# Altium schematic sheet SHDN-CURRENT-S06-V00-5kWSimulation.SchDoc: 5kW Simulation
size A3; DrawnBy: Jonn Dillon; DocumentNumber: 5; SheetNumber: 5; SheetTotal: 14; Project: Shutdown Current Board 2020
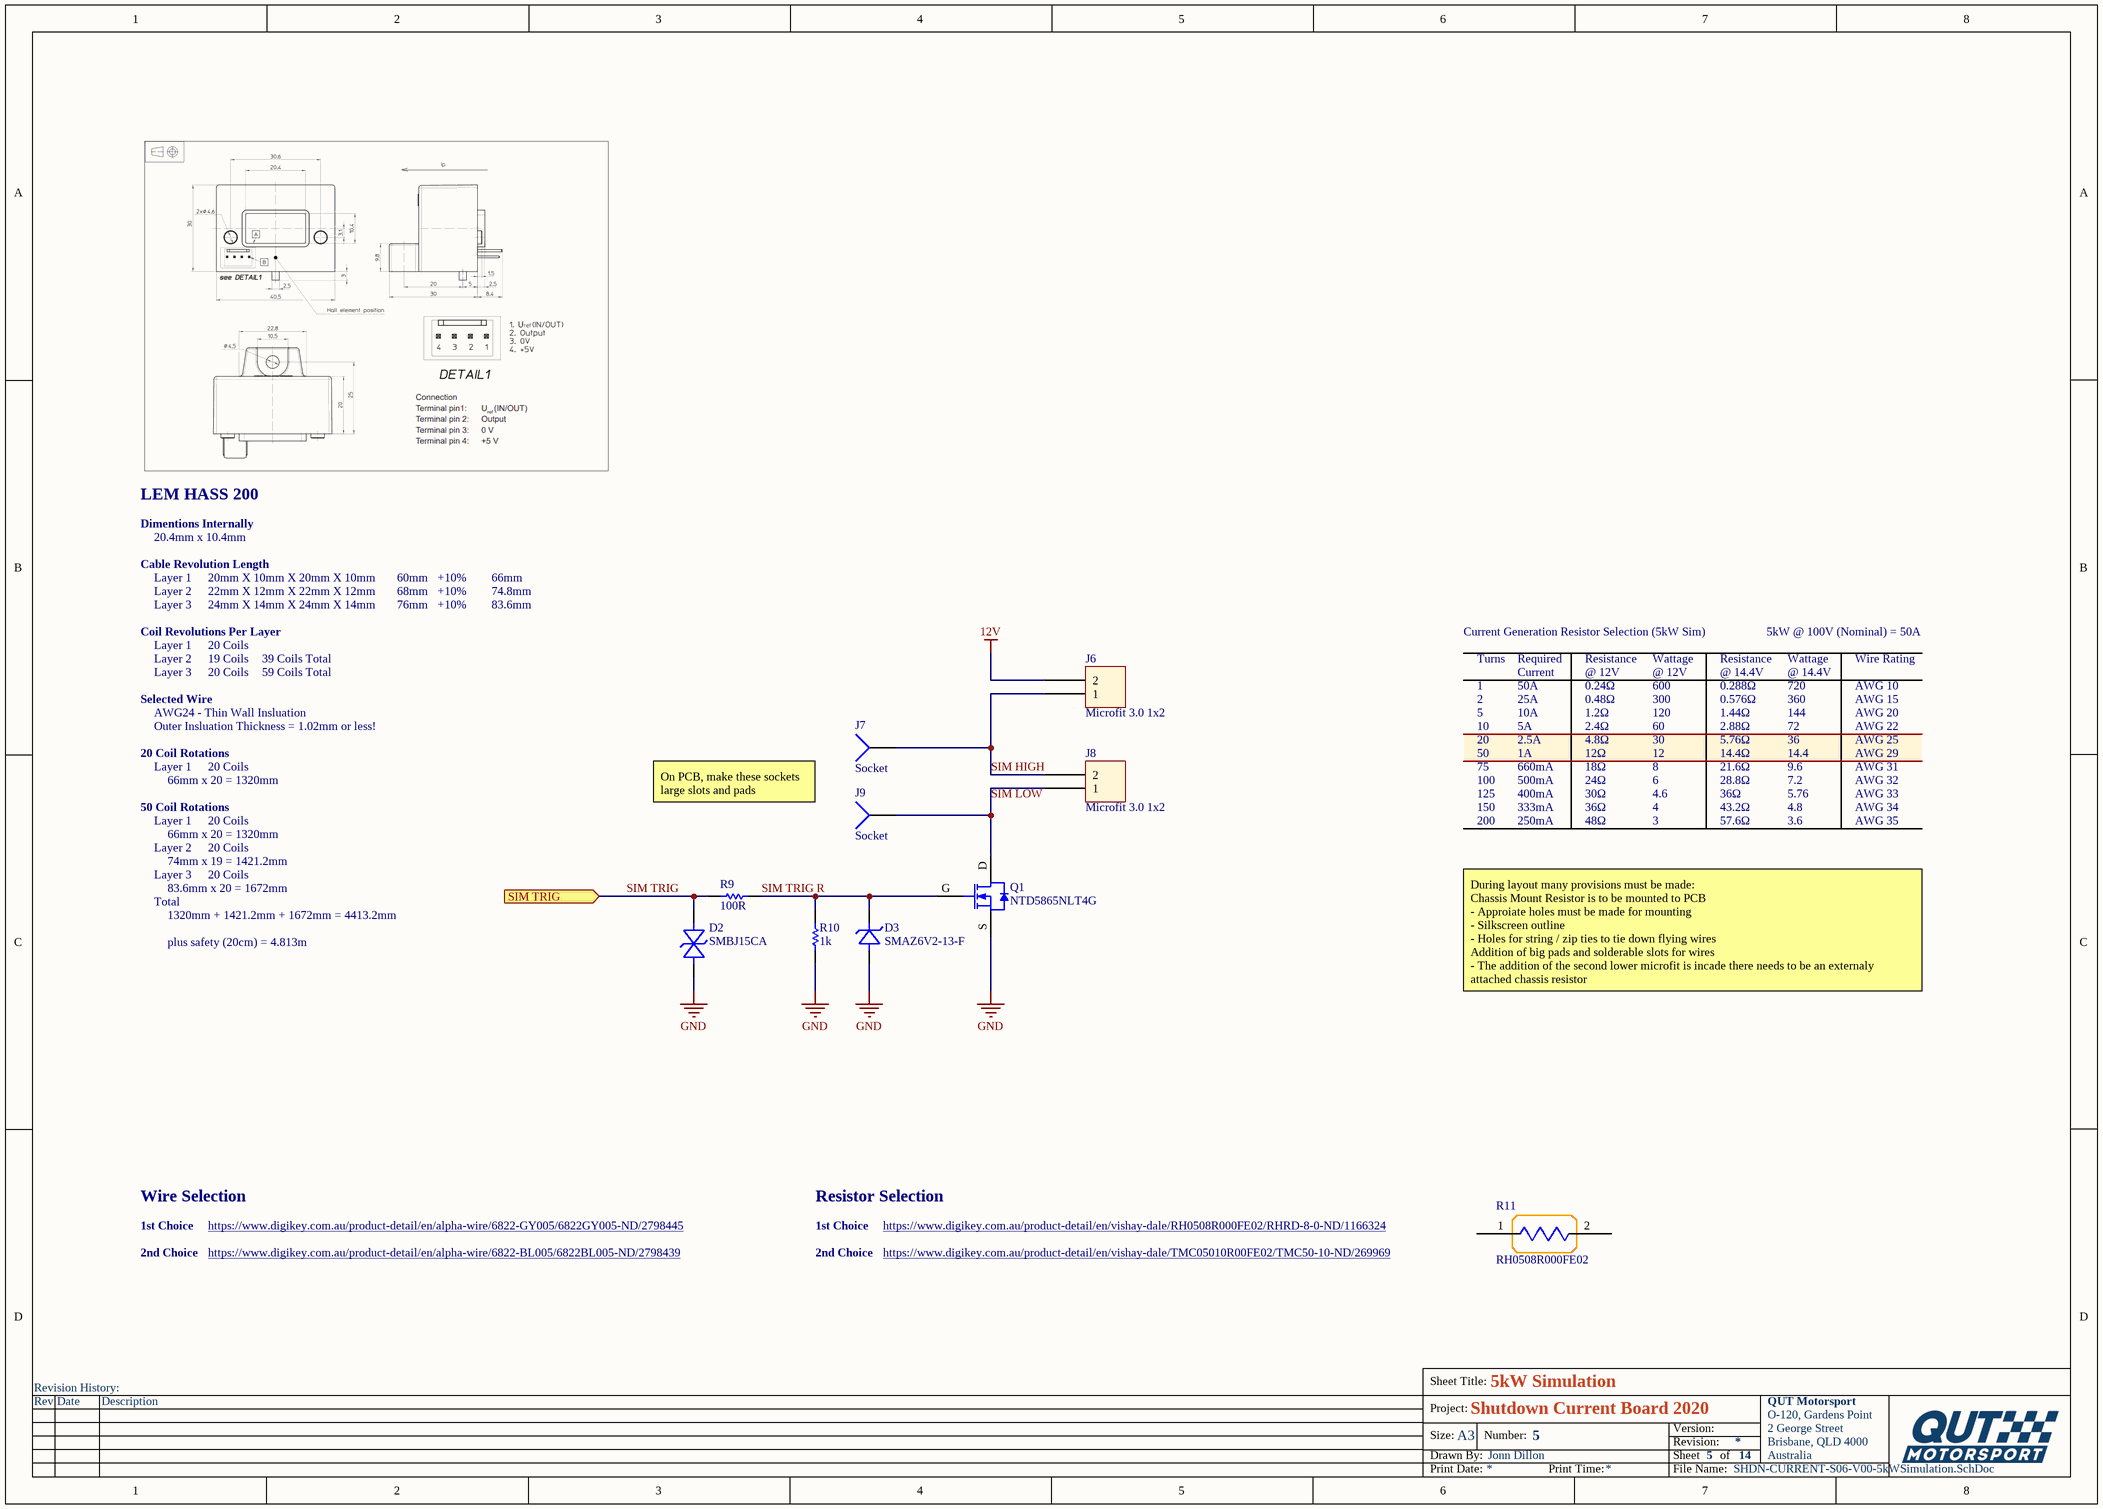
[diagram p0: SHDN-CURRENT-S06-V00-5kWSimulation.SchDoc]

## Parts
D2  SMBJ15CA  [SMB]
D3  SMAZ6V2-13-F  [SMA]
J6  Microfit 3.0 1x2  [Microfit_1X2_R_TH]
J7  Socket  [PIN1]
J8  Microfit 3.0 1x2  [Microfit_1X2_R_TH]
J9  Socket  [PIN1]
Q1  NTD5865NLT4G  [DPAK TO-252]
R9  100R  [Res_ThinFilm_0603]
R10  1k  [Res_ThinFilm_0603]
R11  RH0508R000FE02  [RH0508R000FE02]

## Ports
SIM TRIG (in)

## Nets
12V: J6.2
GND: D2.A(Anode) D3.A(Anode) Q1.S R10.1
SIM HIGH: J6.1 J7.1 J8.2
SIM LOW: J8.1 J9.1 Q1.D
SIM TRIG: D2.K(Cathode) R9.1 ; port SIM TRIG
SIM TRIG R: D3.K(Cathode) Q1.G R9.2 R10.2

Not connected (* = marked no-connect by the designer): R11 1 2

## Notes on the sheet
- LEM HASS 200
- Dimentions Internally
- Cable Revolution Length
- 20.4mm x 10.4mm
- Layer 1
- 20mm X 10mm X 20mm X 10mm
- 60mm
- +10%
- 66mm
- Coil Revolutions Per Layer
- Layer 2
- Layer 3
- 22mm X 12mm X 22mm X 12mm
- 24mm X 14mm X 24mm X 14mm
- 20 Coils
- 68mm
- 76mm
- 74.8mm
- 83.6mm
- Current Generation Resistor Selection (5kW Sim)
- 5kW @ 100V (Nominal) = 50A
- Selected Wire
- AWG24 - Thin Wall Insluation
- 19 Coils
- 39 Coils Total
- 59 Coils Total
- Turns
- 1
- 2
- 5
- Required
- 50A
- 25A
- 10A
- Current
- 0.24Ω
- Resistance
- @ 12V
- 0.48Ω
- 1.2Ω
- 600
- Wattage
- 300
- 120
- @ 14.4V
- 0.288Ω
- 0.576Ω
- 1.44Ω
- 720
- 360
- 144
- Wire Rating
- AWG 10
- AWG 15
- AWG 20
- 20 Coil Rotations
- Outer Insluation Thickness = 1.02mm or less!
- 66mm x 20 = 1320mm
- 10
- 75
- 100
- 20
- 50
- 5A
- 660mA
- 500mA
- 2.5A
- 1A
- 2.4Ω
- 18Ω
- 24Ω
- 4.8Ω
- 12Ω
- 60
- 8
- 6
- 30
- 12
- 2.88Ω
- 21.6Ω
- 28.8Ω
- 5.76Ω
- 14.4Ω
- 72
- 9.6
- 7.2
- 36
- 14.4
- AWG 22
- AWG 31
- AWG 32
- AWG 25
- AWG 29
- 50 Coil Rotations
- On PCB, make these sockets large slots and pads
- 125
- 150
- 200
- 400mA
- 333mA
- 250mA
- 30Ω
- 36Ω
- 48Ω
- 4.6
- 4
- 3
- 43.2Ω
- 57.6Ω
- 5.76
- 4.8
- 3.6
- AWG 33
- AWG 34
- AWG 35
- Total
- 74mm x 19 = 1421.2mm
- 83.6mm x 20 = 1672mm
- 1320mm + 1421.2mm + 1672mm = 4413.2mm
- plus safety (20cm) = 4.813m
- During layout many provisions must be made:
  Chassis Mount Resistor is to be mounted to PCB
  - Approiate holes must be made for mounting
  - Silkscreen outline
  - Holes for string / zip ties to tie down flying wires
  Addition of big pads and solderable slots for wires
  - The addition of the second lower microfit is incade there needs to be an externaly attached chassis resistor
- 1st Choice
- 2nd Choice
- Wire Selection
- https://www.digikey.com.au/product-detail/en/alpha-wire/6822-BL005/6822BL005-ND/2798439
- https://www.digikey.com.au/product-detail/en/alpha-wire/6822-GY005/6822GY005-ND/2798445
- Resistor Selection
- https://www.digikey.com.au/product-detail/en/vishay-dale/TMC05010R00FE02/TMC50-10-ND/269969
- https://www.digikey.com.au/product-detail/en/vishay-dale/RH0508R000FE02/RHRD-8-0-ND/1166324
- Revision History:
- Sheet Title:
- Rev
- Date
- Description
- Project:
- Size:
- Drawn By:
- A3
- Number:
- Revision:
- Sheet
- Version:
- of
- QUT Motorsport
- O-120, Gardens Point
- 2 George Street
- Brisbane, QLD 4000
- Australia
- Print Date:
- Print Time:
- File Name:

## Library data of the parts
D2 = SMBJ15CA: Diode, SMD, TVS Diode, 15V 24.4V, DO214AA/SMB; ComponentLink1Description: Digikey; ComponentLink1URL: https://www.digikey.com.au/product-detail/en/littelfuse-inc/SMBJ15CA/SMBJ15CALFCT-ND/285983; ComponentLink2Description: Datasheet; ComponentLink2URL: https://www.littelfuse.com/~/media/electronics/datasheets/tvs_diodes/littelfuse_tvs_diode_smbj_datasheet.pdf.pdf
D3 = SMAZ6V2-13-F: Zener Diode 6.2V 1W ±5% Surface Mount SMA; Manufacturer: Generic; MPN: 5V6 500mW SMA
J6 J8 = Microfit_1x2
Q1 = NTD5865NLT4G: NTD5865NLT4G, 60V 46A
R9 = 100R 5%, 0603: Resistor, SMD, 100R, 0.1W, 5%, 0603
R10 = 1k 5% 0603: Resistor, SMD, 1k, 0.1W, 5%, 0603
R11 = RH0508R000FE02: 8 Ohms ±1% 50W Wirewound Chassis Mount Resistor; ComponentLink1Description: Digikey; ComponentLink1URL: https://www.digikey.com.au/product-detail/en/vishay-dale/RH0508R000FE02/RHRD-8-0-ND/1166324; ComponentLink2Description: Datasheet; ComponentLink2URL: https://www.vishay.com/docs/30201/rhnh.pdf
J7 J9 = Socket: LatestRevisionDate: 17-Jul-2002; LatestRevisionNote: Re-released for DXP Platform.; Publisher: Altium Limited